# Altium schematic sheet 99 - INFO_DEBUG.SchDoc
size A4; DocumentNumber: 3; SheetNumber: 3; SheetTotal: 3; SchemaTitle: Title?
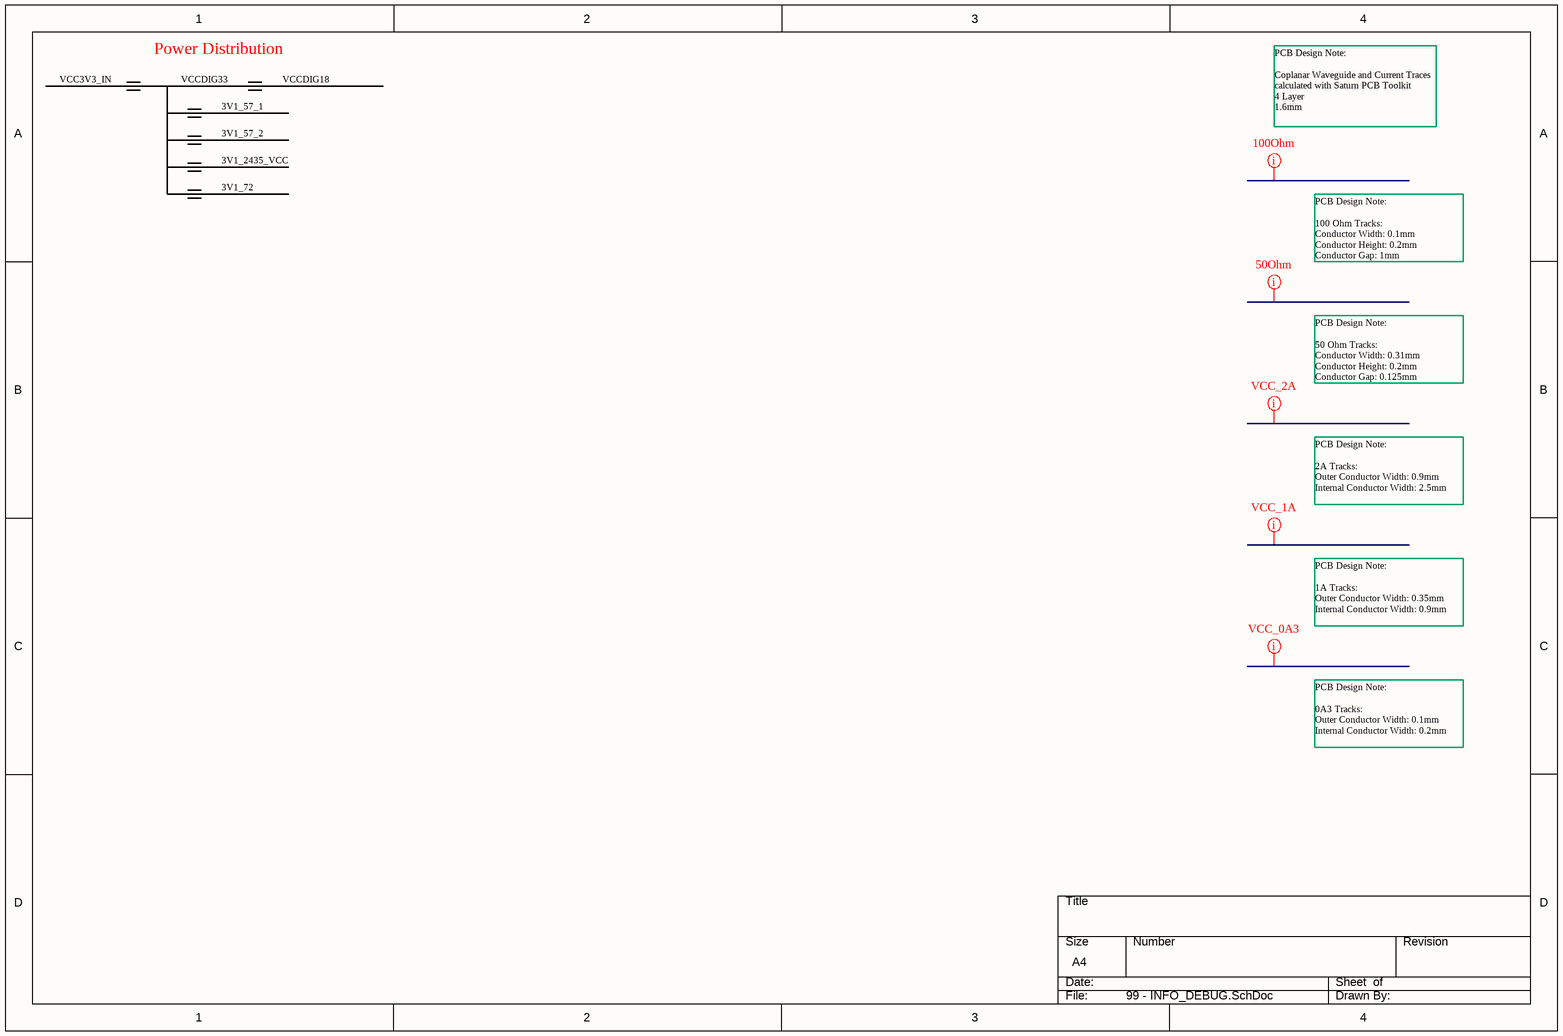
[diagram p0: 99 - INFO_DEBUG.SchDoc]

## Layout directives
net class 100Ohm: (no net found under the mark)
net class 50Ohm: (no net found under the mark)
net class VCC_2A: (no net found under the mark)
net class VCC_1A: (no net found under the mark)
net class VCC_0A3: (no net found under the mark)

## Notes on the sheet
- VCC3V3_IN
- Power Distribution
- VCCDIG33
- 3V1_57_1
- VCCDIG18
- 3V1_57_2
- 3V1_2435_VCC
- PCB Design Note:
  Coplanar Waveguide and Current Traces calculated with Saturn PCB Toolkit
  4 Layer
  1.6mm
- 3V1_72
- PCB Design Note:
  100 Ohm Tracks:
  Conductor Width: 0.1mm
  Conductor Height: 0.2mm
  Conductor Gap: 1mm
- PCB Design Note:
  50 Ohm Tracks:
  Conductor Width: 0.31mm
  Conductor Height: 0.2mm
  Conductor Gap: 0.125mm
- PCB Design Note:
  2A Tracks:
  Outer Conductor Width: 0.9mm
  Internal Conductor Width: 2.5mm
- PCB Design Note:
  1A Tracks:
  Outer Conductor Width: 0.35mm
  Internal Conductor Width: 0.9mm
- PCB Design Note:
  0A3 Tracks:
  Outer Conductor Width: 0.1mm
  Internal Conductor Width: 0.2mm
- THIS DOCUMENT AND THE DATA DISCLOSED HEREIN OR
- HEREWITH IS THE PROPERTY OF ALTIUM LIMITED AND MAY
- DWG NO:
- REVISION
- REV:
- DESCRIPTION
- DATE
- APPROVED
- BE FREELY DISTRIBUTED IN WHOLE. NO RIGHTS ARE
- RESERVED OR EXPRESS OR IMPLIED WARANTEE GIVEN.
- ENG:
- APPROVALS
- PROJECT
- DSN:
- CHK:
- REFERENCE DOCUMENTS
- PROJECT REVISION:
- TITLE
- DOCUMENT REVISION:
- DESIGN ITEM:
- BOM:
- FAB DWG:
- PCB DWG:
- ASSY DWG:
- SCALE:
- A3
- SIZE
- CAGE CODE
- FILE NAME
- DWG NO.
- SHEET
- OF
- REV